# Altium project OpenBMS.PrjPcb (part 3 of 3)

## Sheet Charging.SchDoc: Charging controller
size 420 x 297 mm; ENG_APP_DATE: --/--/--; DSN_APP_DATE: --/--/--; CHK_APP_DATE: --/--/--
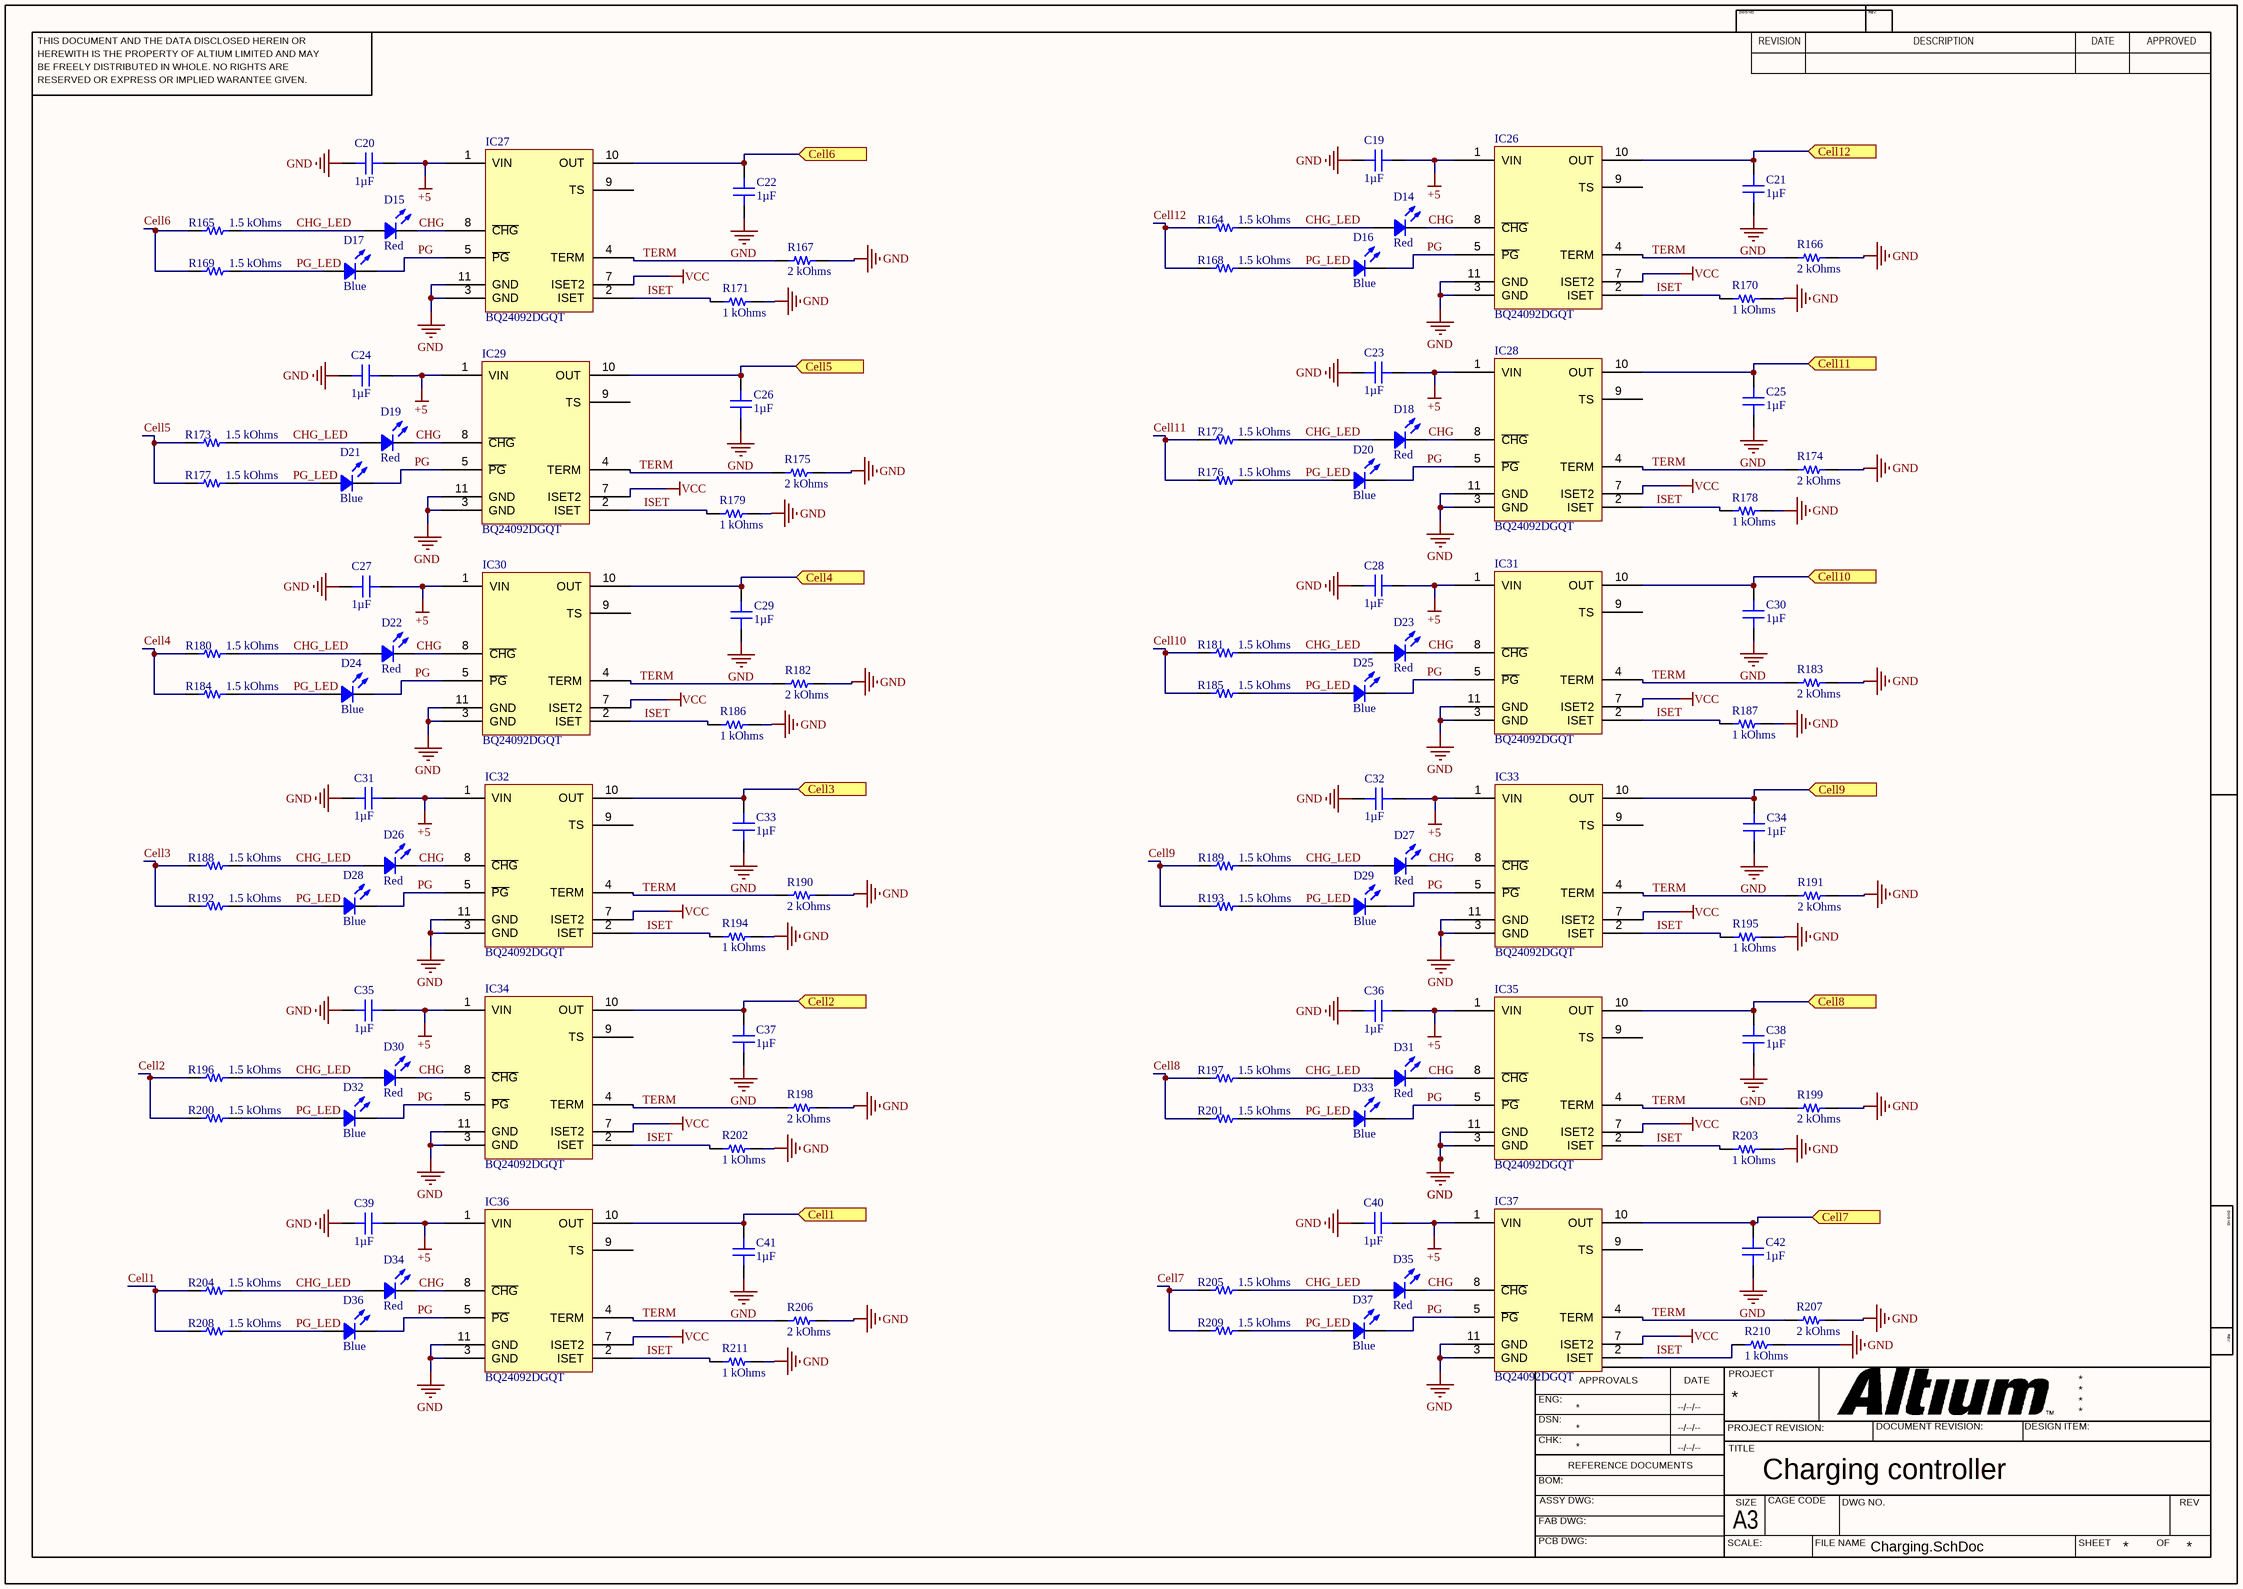
[diagram p5: Charging.SchDoc]

### Parts
C19  1µF  [CAP 0603_1608]
C20  1µF  [CAP 0603_1608]
C21  1µF  [CAP 0603_1608]
C22  1µF  [CAP 0603_1608]
C23  1µF  [CAP 0603_1608]
C24  1µF  [CAP 0603_1608]
C25  1µF  [CAP 0603_1608]
C26  1µF  [CAP 0603_1608]
C27  1µF  [CAP 0603_1608]
C28  1µF  [CAP 0603_1608]
C29  1µF  [CAP 0603_1608]
C30  1µF  [CAP 0603_1608]
C31  1µF  [CAP 0603_1608]
C32  1µF  [CAP 0603_1608]
C33  1µF  [CAP 0603_1608]
C34  1µF  [CAP 0603_1608]
C35  1µF  [CAP 0603_1608]
C36  1µF  [CAP 0603_1608]
C37  1µF  [CAP 0603_1608]
C38  1µF  [CAP 0603_1608]
C39  1µF  [CAP 0603_1608]
C40  1µF  [CAP 0603_1608]
C41  1µF  [CAP 0603_1608]
C42  1µF  [CAP 0603_1608]
D14  Red  [LED 0603_1608 RED]
D15  Red  [LED 0603_1608 RED]
D16  Blue  [LED 0603_1608 BLUE]
D17  Blue  [LED 0603_1608 BLUE]
D18  Red  [LED 0603_1608 RED]
D19  Red  [LED 0603_1608 RED]
D20  Blue  [LED 0603_1608 BLUE]
D21  Blue  [LED 0603_1608 BLUE]
D22  Red  [LED 0603_1608 RED]
D23  Red  [LED 0603_1608 RED]
D24  Blue  [LED 0603_1608 BLUE]
D25  Blue  [LED 0603_1608 BLUE]
D26  Red  [LED 0603_1608 RED]
D27  Red  [LED 0603_1608 RED]
D28  Blue  [LED 0603_1608 BLUE]
D29  Blue  [LED 0603_1608 BLUE]
D30  Red  [LED 0603_1608 RED]
D31  Red  [LED 0603_1608 RED]
D32  Blue  [LED 0603_1608 BLUE]
D33  Blue  [LED 0603_1608 BLUE]
D34  Red  [LED 0603_1608 RED]
D35  Red  [LED 0603_1608 RED]
D36  Blue  [LED 0603_1608 BLUE]
D37  Blue  [LED 0603_1608 BLUE]
IC26  BQ24092DGQT  [TI PDSO-10 DCQ]
IC27  BQ24092DGQT  [TI PDSO-10 DCQ]
IC28  BQ24092DGQT  [TI PDSO-10 DCQ]
IC29  BQ24092DGQT  [TI PDSO-10 DCQ]
IC30  BQ24092DGQT  [TI PDSO-10 DCQ]
IC31  BQ24092DGQT  [TI PDSO-10 DCQ]
IC32  BQ24092DGQT  [TI PDSO-10 DCQ]
IC33  BQ24092DGQT  [TI PDSO-10 DCQ]
IC34  BQ24092DGQT  [TI PDSO-10 DCQ]
IC35  BQ24092DGQT  [TI PDSO-10 DCQ]
IC36  BQ24092DGQT  [TI PDSO-10 DCQ]
IC37  BQ24092DGQT  [TI PDSO-10 DCQ]
R164  1.5 kOhms  [RES 0603_1608]
R165  1.5 kOhms  [RES 0603_1608]
R166  2 kOhms  [RES 0603_1608]
R167  2 kOhms  [RES 0603_1608]
R168  1.5 kOhms  [RES 0603_1608]
R169  1.5 kOhms  [RES 0603_1608]
R170  1 kOhms  [RES 0603_1608]
R171  1 kOhms  [RES 0603_1608]
R172  1.5 kOhms  [RES 0603_1608]
R173  1.5 kOhms  [RES 0603_1608]
R174  2 kOhms  [RES 0603_1608]
R175  2 kOhms  [RES 0603_1608]
R176  1.5 kOhms  [RES 0603_1608]
R177  1.5 kOhms  [RES 0603_1608]
R178  1 kOhms  [RES 0603_1608]
R179  1 kOhms  [RES 0603_1608]
R180  1.5 kOhms  [RES 0603_1608]
R181  1.5 kOhms  [RES 0603_1608]
R182  2 kOhms  [RES 0603_1608]
R183  2 kOhms  [RES 0603_1608]
R184  1.5 kOhms  [RES 0603_1608]
R185  1.5 kOhms  [RES 0603_1608]
R186  1 kOhms  [RES 0603_1608]
R187  1 kOhms  [RES 0603_1608]
R188  1.5 kOhms  [RES 0603_1608]
R189  1.5 kOhms  [RES 0603_1608]
R190  2 kOhms  [RES 0603_1608]
R191  2 kOhms  [RES 0603_1608]
R192  1.5 kOhms  [RES 0603_1608]
R193  1.5 kOhms  [RES 0603_1608]
R194  1 kOhms  [RES 0603_1608]
R195  1 kOhms  [RES 0603_1608]
R196  1.5 kOhms  [RES 0603_1608]
R197  1.5 kOhms  [RES 0603_1608]
R198  2 kOhms  [RES 0603_1608]
R199  2 kOhms  [RES 0603_1608]
R200  1.5 kOhms  [RES 0603_1608]
R201  1.5 kOhms  [RES 0603_1608]
R202  1 kOhms  [RES 0603_1608]
R203  1 kOhms  [RES 0603_1608]
R204  1.5 kOhms  [RES 0603_1608]
R205  1.5 kOhms  [RES 0603_1608]
R206  2 kOhms  [RES 0603_1608]
R207  2 kOhms  [RES 0603_1608]
R208  1.5 kOhms  [RES 0603_1608]
R209  1.5 kOhms  [RES 0603_1608]
R210  1 kOhms  [RES 0603_1608]
R211  1 kOhms  [RES 0603_1608]

### Ports
Cell1 (in), Cell2 (in), Cell3 (in), Cell4 (in), Cell5 (in), Cell6 (in), Cell7 (in), Cell8 (in), Cell9 (in), Cell10 (in), Cell11 (in), Cell12 (in)

### Nets
+5: C19.2 C20.2 C23.2 C24.2 C27.2 C28.2 C31.2 C32.2 C35.2 C36.2 C39.2 C40.2 IC26.1(VIN) IC27.1(VIN) IC28.1(VIN) IC29.1(VIN) IC30.1(VIN) IC31.1(VIN) IC32.1(VIN) IC33.1(VIN) IC34.1(VIN) IC35.1(VIN) IC36.1(VIN) IC37.1(VIN)
GND: C19.1 C20.1 C21.1 C22.1 C23.1 C24.1 C25.1 C26.1 C27.1 C28.1 C29.1 C30.1 C31.1 C32.1 C33.1 C34.1 C35.1 C36.1 C37.1 C38.1 C39.1 C40.1 C41.1 C42.1 IC26.3(GND) IC26.11(GND) IC27.3(GND) IC27.11(GND) IC28.3(GND) IC28.11(GND) IC29.3(GND) IC29.11(GND) IC30.3(GND) IC30.11(GND) IC31.3(GND) IC31.11(GND) IC32.3(GND) IC32.11(GND) IC33.3(GND) IC33.11(GND) IC34.3(GND) IC34.11(GND) IC35.3(GND) IC35.11(GND) IC36.3(GND) IC36.11(GND) IC37.3(GND) IC37.11(GND) R166.1 R167.1 R170.1 R171.1 R174.1 R175.1 R178.1 R179.1 R182.1 R183.1 R186.1 R187.1 R190.1 R191.1 R194.1 R195.1 R198.1 R199.1 R202.1 R203.1 R206.1 R207.1 R210.1 R211.1
VCC: IC26.7(ISET2) IC27.7(ISET2) IC28.7(ISET2) IC29.7(ISET2) IC30.7(ISET2) IC31.7(ISET2) IC32.7(ISET2) IC33.7(ISET2) IC34.7(ISET2) IC35.7(ISET2) IC36.7(ISET2) IC37.7(ISET2)
Cell1: R204.1 R208.1
Cell2: R196.1 R200.1
Cell3: R188.1 R192.1
Cell4: R180.1 R184.1
Cell5: R173.1 R177.1
Cell6: R165.1 R169.1
Cell7: R205.1 R209.1
Cell8: R197.1 R201.1
Cell9: R189.1 R193.1
Cell10: R181.1 R185.1
Cell11: R172.1 R176.1
Cell12: R164.1 R168.1
CHG: D14.2 D15.2 D18.2 D19.2 D22.2 D23.2 D26.2 D27.2 D30.2 D31.2 D34.2 D35.2 IC26.8(~{CHG}) IC27.8(~{CHG}) IC28.8(~{CHG}) IC29.8(~{CHG}) IC30.8(~{CHG}) IC31.8(~{CHG}) IC32.8(~{CHG}) IC33.8(~{CHG}) IC34.8(~{CHG}) IC35.8(~{CHG}) IC36.8(~{CHG}) IC37.8(~{CHG})
CHG_LED: D14.1 D15.1 D18.1 D19.1 D22.1 D23.1 D26.1 D27.1 D30.1 D31.1 D34.1 D35.1 R164.2 R165.2 R172.2 R173.2 R180.2 R181.2 R188.2 R189.2 R196.2 R197.2 R204.2 R205.2
ISET: IC26.2(ISET) IC27.2(ISET) IC28.2(ISET) IC29.2(ISET) IC30.2(ISET) IC31.2(ISET) IC32.2(ISET) IC33.2(ISET) IC34.2(ISET) IC35.2(ISET) IC36.2(ISET) IC37.2(ISET) R170.2 R171.2 R178.2 R179.2 R186.2 R187.2 R194.2 R195.2 R202.2 R203.2 R210.2 R211.2
PG: D16.2 D17.2 D20.2 D21.2 D24.2 D25.2 D28.2 D29.2 D32.2 D33.2 D36.2 D37.2 IC26.5(~{PG}) IC27.5(~{PG}) IC28.5(~{PG}) IC29.5(~{PG}) IC30.5(~{PG}) IC31.5(~{PG}) IC32.5(~{PG}) IC33.5(~{PG}) IC34.5(~{PG}) IC35.5(~{PG}) IC36.5(~{PG}) IC37.5(~{PG})
PG_LED: D16.1 D17.1 D20.1 D21.1 D24.1 D25.1 D28.1 D29.1 D32.1 D33.1 D36.1 D37.1 R168.2 R169.2 R176.2 R177.2 R184.2 R185.2 R192.2 R193.2 R200.2 R201.2 R208.2 R209.2
TERM: IC26.4(TERM) IC27.4(TERM) IC28.4(TERM) IC29.4(TERM) IC30.4(TERM) IC31.4(TERM) IC32.4(TERM) IC33.4(TERM) IC34.4(TERM) IC35.4(TERM) IC36.4(TERM) IC37.4(TERM) R166.2 R167.2 R174.2 R175.2 R182.2 R183.2 R190.2 R191.2 R198.2 R199.2 R206.2 R207.2
NetC21_2: C21.2 IC26.10(OUT) ; port Cell12
NetC22_2: C22.2 IC27.10(OUT) ; port Cell6
NetC25_2: C25.2 IC28.10(OUT) ; port Cell11
NetC26_2: C26.2 IC29.10(OUT) ; port Cell5
NetC29_2: C29.2 IC30.10(OUT) ; port Cell4
NetC30_2: C30.2 IC31.10(OUT) ; port Cell10
NetC33_2: C33.2 IC32.10(OUT) ; port Cell3
NetC34_2: C34.2 IC33.10(OUT) ; port Cell9
NetC37_2: C37.2 IC34.10(OUT) ; port Cell2
NetC38_2: C38.2 IC35.10(OUT) ; port Cell8
NetC41_2: C41.2 IC36.10(OUT) ; port Cell1
NetC42_2: C42.2 IC37.10(OUT) ; port Cell7

Not connected (* = marked no-connect by the designer): IC26 9(TS); IC27 9(TS); IC28 9(TS); IC29 9(TS); IC30 9(TS); IC31 9(TS); IC32 9(TS); IC33 9(TS); IC34 9(TS); IC35 9(TS); IC36 9(TS); IC37 9(TS)

### Notes on the sheet
- THIS DOCUMENT AND THE DATA DISCLOSED HEREIN OR
- HEREWITH IS THE PROPERTY OF ALTIUM LIMITED AND MAY
- DWG NO:
- REVISION
- REV:
- DESCRIPTION
- DATE
- APPROVED
- BE FREELY DISTRIBUTED IN WHOLE. NO RIGHTS ARE
- RESERVED OR EXPRESS OR IMPLIED WARANTEE GIVEN.
- ENG:
- APPROVALS
- PROJECT
- DSN:
- CHK:
- REFERENCE DOCUMENTS
- PROJECT REVISION:
- TITLE
- DOCUMENT REVISION:
- DESIGN ITEM:
- BOM:
- FAB DWG:
- PCB DWG:
- ASSY DWG:
- SCALE:
- A3
- SIZE
- CAGE CODE
- FILE NAME
- DWG NO.
- SHEET
- OF
- REV

### Library data of the parts
C19-C42 = CC0603KRX5R8BB105: CAP CER 1UF 25V X5R 0603; Manufacturer: Yageo; Tolerance: ±10%; Part Number: CC0603KRX5R8BB105; Value: 1µF; Applications: General Purpose; Capacitance: 1µF; ComponentLink1Description: Datasheet; ComponentLink1URL: https://www.yageo.com/upload/media/product/productsearch/datasheet/mlcc/UPY-GPHC_X5R_4V-to-50V_25.pdf; ComponentLink2Description: DigiKey Link; ComponentLink2URL: http://digikey.com/product-detail/en/yageo/CC0603KRX5R8BB105/311-1445-1-ND/2833751; Device Package: 0603 (1608 Metric); LastUpdated: 21/01/2020 00:02:05; Lifecycle Status: Active; Minimum Order: 1; Mounting Type: Surface Mount, MLCC; Operating Temperature: -55°C ~ 85°C; Package / Case: 0603 (1608 Metric); Packaging: TapeAndReel; PartId: 5146; Part Status: Active; Price: 0.01; Series: CC; Size / Dimension: 0.063" L x 0.031" W (1.60mm x 0.80mm); Supplier 1: DigiKey; Supplier Part Number 1: 311-1445-1-ND; Temperature Coefficient: X5R; Thickness (Max): 0.035" (0.90mm); Voltage - Rated: 25V
D14 D15 D18 D19 D22 D23 D26 D27 D30 D31 D34 D35 = 19-213USRC/S259/TR8: LED RED CLEAR 2SMD; Manufacturer: Everlight Electronics Co Ltd; Configuration: Standard; Current - Test: 25mA; Lens Color: Colorless; Lens Size: 1.20mm x 0.80mm; Lens Style: Rectangle with Flat Top; Viewing Angle: 120°; Voltage - Forward (Vf) (Typ): 2.1V; Wavelength - Peak: 639nm; Part Number: 19-213USRC/S259/TR8; Color: Red; ComponentLink1Description: Datasheet; ComponentLink1URL: //media.digikey.com/pdf/Data%20Sheets/Everlight%20PDFs/19-213USRC-S259-TR8.pdf; ComponentLink2Description: DigiKey Link; ComponentLink2URL: http://digikey.com/product-detail/en/everlight-electronics-co-ltd/19-213USRC-S259-TR8/1080-1583-1-ND/8535306; Device Package: 0603 (1608 Metric); Height (Max): 0.70mm; LastUpdated: 21/01/2020 03:13:21; Lens Transparency: Clear; Lifecycle Status: Active; Minimum Order: 1; Mounting Type: Surface Mount; Package / Case: 0603 (1608 Metric); Packaging: TapeAndReel; PartId: 415; Part Status: Active; Price: 0.03; Series: -; Size / Dimension: 1.60mm L x 0.80mm W; Supplier 1: DigiKey; Supplier Part Number 1: 1080-1583-1-ND; Supplier Device Package: 2-SMD; Value: Red
D16 D17 D20 D21 D24 D25 D28 D29 D32 D33 D36 D37 = EAST16084BA8: LED BLUE CLEAR 2SMD; Manufacturer: Everlight Electronics Co Ltd; Configuration: Standard; Current - Test: 5mA; Lens Color: Colorless; Lens Size: 1.00mm x 0.80mm; Lens Style: Rectangle with Flat Top; Viewing Angle: 120°; Voltage - Forward (Vf) (Typ): 2.8V; Wavelength - Peak: 468nm; Part Number: EAST16084BA8; Color: Blue; ComponentLink1Description: Datasheet; ComponentLink1URL: https://everlightamericas.com/index.php?controller=attachment&id_attachment=3217; ComponentLink2Description: DigiKey Link; ComponentLink2URL: http://digikey.com/product-detail/en/everlight-electronics-co-ltd/EAST16084BA8/1080-1562-1-ND/8510390; Device Package: 0603 (1608 Metric); Height (Max): 0.50mm; LastUpdated: 21/01/2020 03:10:56; Lens Transparency: Clear; Lifecycle Status: Active; Minimum Order: 1; Mounting Type: Surface Mount; Package / Case: 0603 (1608 Metric); Packaging: TapeAndReel; PartId: 800; Part Status: Active; Price: 0.05; Series: -; Size / Dimension: 1.60mm L x 0.80mm W; Supplier 1: DigiKey; Supplier Part Number 1: 1080-1562-1-ND; Supplier Device Package: 2-SMD; Value: Blue
IC26-IC37 = BQ24092DGQT: IC BATT CHARGER LI-ION 10MSOP; Manufacturer: Texas Instruments; Battery Chemistry: Lithium Ion/Polymer; Battery Pack Voltage: 4.2V; Charge Current - Max: 1A; Current - Charging: Constant - Programmable; Fault Protection: Over Temperature, Over Voltage, Short Circuit; Interface: USB; Number of Cells: 1; Programmable Features: Current; Voltage - Supply (Max): 6.45V; Part Number: BQ24092DGQT; ComponentLink1Description: Datasheet; ComponentLink1URL: http://www.ti.com/general/docs/suppproductinfo.tsp?distId=10&gotoUrl=http%3A%2F%2Fwww.ti.com%2Flit%2Fgpn%2Fbq24092; ComponentLink2Description: DigiKey Link; ComponentLink2URL: //digikey.com/product-detail/en/texas-instruments/BQ24092DGQT/296-27510-2-ND/2325817; Device Package: 10-TFSOP, 10-MSOP (0.118", 3.00mm Width) Exposed Pad; LastUpdated: 08/12/2019 03:15:42; Lifecycle Status: 0; Minimum Order: 1; Mounting Type: Surface Mount; Operating Temperature: 0°C ~ 125°C (TJ); Package / Case: 10-TFSOP, 10-MSOP (0.118", 3.00mm Width) Exposed Pad; Packaging: TapeAndReel; PartId: 25; Part Status: Active; Price: 0.83; Series: -; Supplier 1: DigiKey; Supplier Part Number 1: 296-27510-2-ND; Supplier Device Package: 10-MSOP-PowerPad
R164 R165 R168 R169 R172 R173 R176 R177 R180 R181 R184 R185 R188 R189 R192 R193 R196 R197 R200 R201 R204 R205 R208 R209 = ERJ-3EKF1501V: RES SMD 1.5K OHM 1% 1/10W 0603; Manufacturer: Panasonic Electronic Components; Power (Watts): 0.1W, 1/10W; Temperature Coefficient: ±100ppm/°C; Part Number: ERJ-3EKF1501V; Value: 1.5 kOhms; ComponentLink1Description: Datasheet; ComponentLink1URL: https://industrial.panasonic.com/cdbs/www-data/pdf/RDA0000/AOA0000C304.pdf; ComponentLink2Description: DigiKey Link; ComponentLink2URL: http://digikey.com/product-detail/en/panasonic-electronic-components/ERJ-3EKF1501V/P1.50KHCT-ND/198088; Composition: Thick Film; Device Package: 0603 (1608 Metric); Features: Automotive AEC-Q200; Height - Seated (Max): 0.022" (0.55mm); LastUpdated: 21/01/2020 00:24:38; Lifecycle Status: Active; Minimum Order: 1; Number of Terminations: 2; Operating Temperature: -55°C ~ 155°C; Package / Case: 0603 (1608 Metric); Packaging: TapeAndReel; PartId: 5637; Part Status: Active; Price: 0.01; Ratings: AEC-Q200; Resistance: 1.5 kOhms; Series: ERJ; Size / Dimension: 0.063" L x 0.031" W (1.60mm x 0.80mm); Supplier 1: DigiKey; Supplier Part Number 1: P1.50KHCT-ND; Supplier Device Package: 0603; Tolerance: ±1%
R166 R167 R174 R175 R182 R183 R190 R191 R198 R199 R206 R207 = ERJ-PA3J202V: RES SMD 2K OHM 5% 1/4W 0603; Manufacturer: Panasonic Electronic Components; Power (Watts): 0.25W, 1/4W; Temperature Coefficient: ±200ppm/°C; Part Number: ERJ-PA3J202V; Value: 2 kOhms; ComponentLink1Description: Datasheet; ComponentLink1URL: https://industrial.panasonic.com/cdbs/www-data/pdf/RDO0000/AOA0000C331.pdf; ComponentLink2Description: DigiKey Link; ComponentLink2URL: http://digikey.com/product-detail/en/panasonic-electronic-components/ERJ-PA3J202V/P2KBZCT-ND/5036279; Composition: Thick Film; Device Package: 0603 (1608 Metric); Features: Automotive AEC-Q200, Pulse Withstanding; Height - Seated (Max): 0.022" (0.55mm); LastUpdated: 21/01/2020 00:23:23; Lifecycle Status: Active; Minimum Order: 1; Number of Terminations: 2; Operating Temperature: -55°C ~ 155°C; Package / Case: 0603 (1608 Metric); Packaging: TapeAndReel; PartId: 8961; Part Status: Active; Price: 0.01; Ratings: AEC-Q200; Resistance: 2 kOhms; Series: ERJ; Size / Dimension: 0.063" L x 0.031" W (1.60mm x 0.80mm); Supplier 1: DigiKey; Supplier Part Number 1: P2KBZCT-ND; Supplier Device Package: 0603; Tolerance: ±5%
R170 R171 R178 R179 R186 R187 R194 R195 R202 R203 R210 R211 = ERJ-PA3J102V: RES SMD 1K OHM 5% 1/4W 0603; Manufacturer: Panasonic Electronic Components; Power (Watts): 0.25W, 1/4W; Temperature Coefficient: ±200ppm/°C; Part Number: ERJ-PA3J102V; Value: 1 kOhms; ComponentLink1Description: Datasheet; ComponentLink1URL: https://industrial.panasonic.com/cdbs/www-data/pdf/RDO0000/AOA0000C331.pdf; ComponentLink2Description: DigiKey Link; ComponentLink2URL: http://digikey.com/product-detail/en/panasonic-electronic-components/ERJ-PA3J102V/P1KBZCT-ND/5036236; Composition: Thick Film; Device Package: 0603 (1608 Metric); Features: Automotive AEC-Q200, Pulse Withstanding; Height - Seated (Max): 0.022" (0.55mm); LastUpdated: 21/01/2020 00:19:49; Lifecycle Status: Active; Minimum Order: 1; Number of Terminations: 2; Operating Temperature: -55°C ~ 155°C; Package / Case: 0603 (1608 Metric); Packaging: TapeAndReel; PartId: 17507; Part Status: Active; Price: 0.01; Ratings: AEC-Q200; Resistance: 1 kOhms; Series: ERJ; Size / Dimension: 0.063" L x 0.031" W (1.60mm x 0.80mm); Supplier 1: DigiKey; Supplier Part Number 1: P1KBZCT-ND; Supplier Device Package: 0603; Tolerance: ±5%

## Nets that join several sheets
+3V3: Microcontroller (MCU1.17), Display (6 pins)
+5V: Balancing (24 pins), Microcontroller (11 pins), Display (R162.1)
GND: OpenBMS (P?.14), Balancing (14 pins), Measuring (59 pins), Microcontroller (23 pins), Display (C16.1 C17.1 DS1.4 Q26.3), Charging (72 pins)
+21V: OpenBMS (P?.9), Measuring (25 pins)
NetDS1_1: Microcontroller (MCU1.3), Display (DS1.1)
NetDS1_2: Microcontroller (MCU1.24), Display (DS1.2 R160.2)
NetDS1_3: Microcontroller (MCU1.23), Display (DS1.3 R161.2)
NetMCU1_7: Balancing (R81.2), Microcontroller (MCU1.7)
NetMCU1_13: Microcontroller (MCU1.13), Display (R163.1)
NetMCU?_5: Balancing (R84.2), Microcontroller (MCU?.5)
NetMCU?_8: Balancing (R39.2), Microcontroller (MCU?.8)
NetMCU?_9: Balancing (R40.1), Microcontroller (MCU?.9)
NetMCU?_10: Balancing (R41.2), Microcontroller (MCU?.10)
NetMCU?_11: Balancing (R42.2), Microcontroller (MCU?.11)
NetP?_1: OpenBMS (P?.1), Measuring (R147.2)
NetP?_2: OpenBMS (P?.2), Measuring (R136.2)
NetP?_3: OpenBMS (P?.3), Measuring (R135.2)
NetP?_4: OpenBMS (P?.4), Measuring (R124.2)
NetP?_5: OpenBMS (P?.5), Measuring (R123.2)
NetP?_6: OpenBMS (P?.6), Measuring (R112.2)
NetP?_7: OpenBMS (P?.7), Measuring (R111.2)
NetP?_8: OpenBMS (P?.8), Measuring (R100.2)
NetP?_10: OpenBMS (P?.10), Measuring (R88.2)
NetP?_11: OpenBMS (P?.11), Measuring (R87.2)
NetP?_13: OpenBMS (P?.13), Measuring (R148.2)
NTCin: OpenBMS (P?.12), Microcontroller (MCU1.26 R67#2.2)